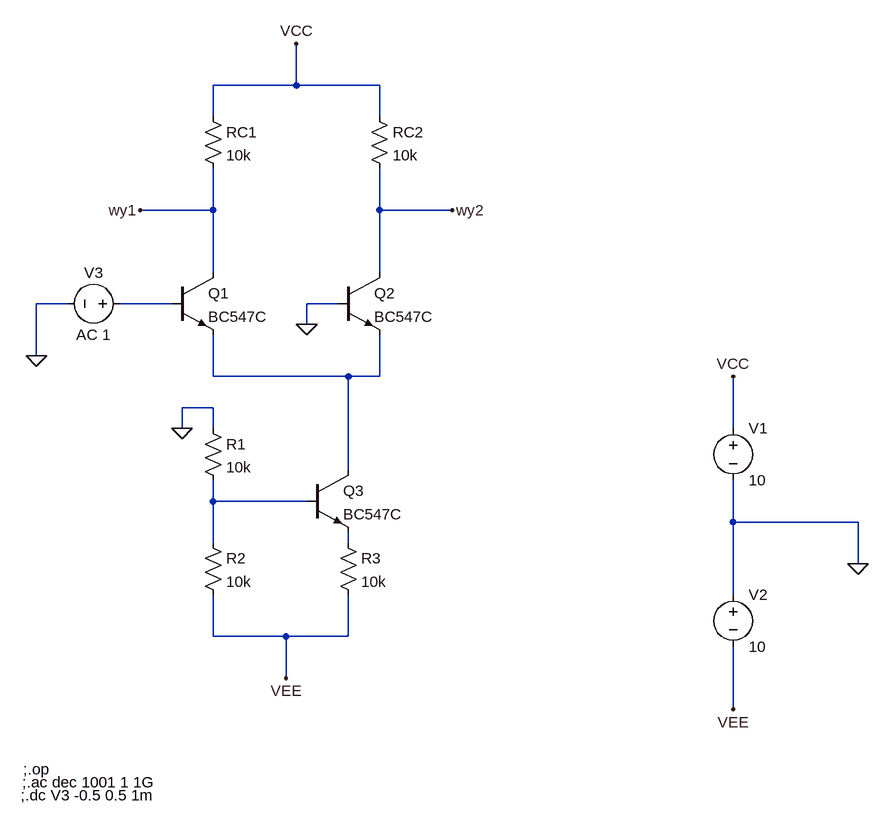
[diagram p0: schematic Draft1.asc]
Draft1.asc, the LTspice schematic file:
Version 4
SHEET 1 1172 1204
WIRE 288 96 288 32
WIRE 288 96 160 96
WIRE 416 96 288 96
WIRE 160 144 160 96
WIRE 416 144 416 96
WIRE 160 288 160 224
WIRE 160 288 48 288
WIRE 416 288 416 224
WIRE 528 288 416 288
WIRE 160 384 160 288
WIRE 416 384 416 288
WIRE -64 432 -112 432
WIRE 96 432 16 432
WIRE 352 432 304 432
WIRE 304 464 304 432
WIRE -112 512 -112 432
WIRE 160 544 160 480
WIRE 368 544 160 544
WIRE 416 544 416 480
WIRE 416 544 368 544
WIRE 160 592 112 592
WIRE 112 624 112 592
WIRE 160 624 160 592
WIRE 960 624 960 544
WIRE 368 688 368 544
WIRE 160 736 160 704
WIRE 304 736 160 736
WIRE 960 768 960 704
WIRE 1152 768 960 768
WIRE 160 800 160 736
WIRE 368 800 368 784
WIRE 1152 832 1152 768
WIRE 960 880 960 768
WIRE 160 944 160 880
WIRE 272 944 160 944
WIRE 368 944 368 880
WIRE 368 944 272 944
WIRE 272 1008 272 944
WIRE 960 1056 960 960
FLAG 304 464 0
FLAG 288 32 VCC
FLAG 48 288 wy1
FLAG 528 288 wy2
FLAG -112 512 0
FLAG 112 624 0
FLAG 272 1008 VEE
FLAG 1152 832 0
FLAG 960 544 VCC
FLAG 960 1056 VEE
SYMBOL res 144 128 R0
SYMATTR InstName RC1
SYMATTR Value 10k
SYMBOL res 400 128 R0
SYMATTR InstName RC2
SYMATTR Value 10k
SYMBOL npn 96 384 R0
SYMATTR InstName Q1
SYMATTR Value BC547C
SYMBOL npn 352 384 R0
SYMATTR InstName Q2
SYMATTR Value BC547C
SYMBOL voltage 32 432 R90
WINDOW 0 -32 56 VBottom 2
WINDOW 3 32 56 VTop 2
SYMATTR InstName V3
SYMATTR Value AC 1
SYMBOL npn 304 688 R0
SYMATTR InstName Q3
SYMATTR Value BC547C
SYMBOL res 144 608 R0
SYMATTR InstName R1
SYMATTR Value 10k
SYMBOL res 144 784 R0
SYMATTR InstName R2
SYMATTR Value 10k
SYMBOL res 352 784 R0
SYMATTR InstName R3
SYMATTR Value 10k
SYMBOL voltage 960 608 R0
WINDOW 123 0 0 Left 0
WINDOW 39 0 0 Left 0
SYMATTR InstName V1
SYMATTR Value 10
SYMBOL voltage 960 864 R0
SYMATTR InstName V2
SYMATTR Value 10
TEXT -132 1148 Left 2 !;.op
TEXT -134 1168 Left 2 !;.ac dec 1001 1 1G
TEXT -136 1188 Left 2 !;.dc V3 -0.5 0.5 1m

The netlist it stands for:
* Draft1.asc
RC1 VCC wy1 10k
RC2 VCC wy2 10k
Q1 wy1 N001 N002 0 BC547C
Q2 wy2 0 N002 0 BC547C
V3 N001 0 AC 1
Q3 N002 N003 N004 0 BC547C
R1 0 N003 10k
R2 N003 VEE 10k
R3 N004 VEE 10k
V1 VCC 0 10
V2 0 VEE 10
.model NPN NPN
.model PNP PNP
.lib standard.bjt
;.op
;.ac dec 1001 1 1G
;.dc V3 -0.5 0.5 1m
.backanno
.end